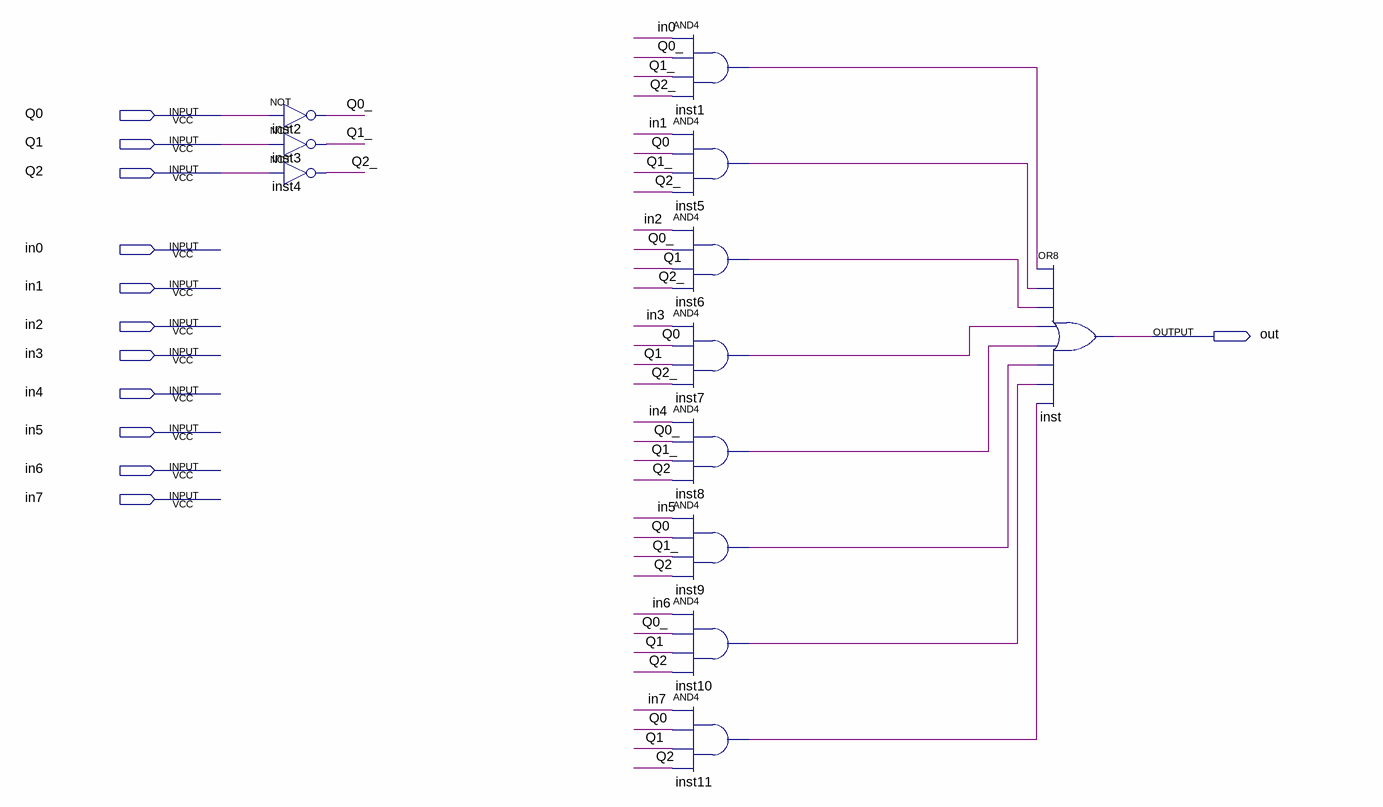
[diagram p0: schematic sheet]
// Quartus schematic L8to1.bdf as structural Verilog: 12 symbols, 12 pins
module L8to1 (
  input  Q0,
  input  Q1,
  input  Q2,
  input  in0,
  input  in1,
  input  in2,
  input  in3,
  input  in4,
  input  in5,
  input  in6,
  input  in7,
  output out
);

  wire inst1_out, inst5_out, inst6_out, inst7_out, inst8_out, inst9_out, inst10_out, inst11_out, Q0_, Q1_,
       Q2_;

  not inst2 (Q0_, Q0);
  not inst3 (Q1_, Q1);
  not inst4 (Q2_, Q2);
  and inst1 (inst1_out, in0, Q0_, Q1_, Q2_);
  and inst5 (inst5_out, in1, Q0, Q1_, Q2_);
  and inst6 (inst6_out, in2, Q0_, Q1, Q2_);
  and inst7 (inst7_out, in3, Q0, Q1, Q2_);
  and inst8 (inst8_out, in4, Q0_, Q1_, Q2);
  and inst9 (inst9_out, in5, Q0, Q1_, Q2);
  and inst10 (inst10_out, in6, Q0_, Q1, Q2);
  and inst11 (inst11_out, in7, Q0, Q1, Q2);
  or inst (out, inst1_out, inst5_out, inst6_out, inst7_out, inst8_out, inst9_out, inst10_out, inst11_out);
endmodule
